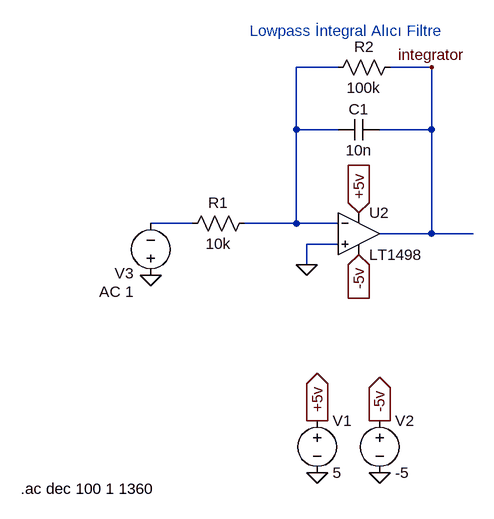
[diagram p0: schematic fluxgateACAnaliz.asc]
fluxgateACAnaliz.asc, the LTspice schematic file:
Version 4
SHEET 1 880 680
WIRE 464 -208 400 -208
WIRE 608 -208 544 -208
WIRE 400 -112 400 -208
WIRE 464 -112 400 -112
WIRE 608 -112 608 -208
WIRE 608 -112 528 -112
WIRE 240 32 176 32
WIRE 400 32 400 -112
WIRE 400 32 320 32
WIRE 464 32 400 32
WIRE 608 48 608 -112
WIRE 608 48 528 48
WIRE 672 48 608 48
WIRE 464 64 416 64
WIRE 416 96 416 64
FLAG 432 416 0
FLAG 432 336 +5v
IOPIN 432 336 Out
FLAG 528 416 0
FLAG 528 336 -5v
IOPIN 528 336 Out
FLAG 496 16 +5v
IOPIN 496 16 In
FLAG 496 80 -5v
IOPIN 496 80 In
FLAG 416 96 0
FLAG 608 -208 integrator
FLAG 176 112 0
SYMBOL voltage 432 320 R0
WINDOW 123 0 0 Left 0
WINDOW 39 0 0 Left 0
SYMATTR InstName V1
SYMATTR Value 5
SYMBOL voltage 528 320 R0
WINDOW 123 0 0 Left 0
WINDOW 39 0 0 Left 0
SYMATTR InstName V2
SYMATTR Value -5
SYMBOL OpAmps\\LT1498 496 -16 R0
SYMATTR InstName U2
SYMBOL res 336 16 R90
WINDOW 0 0 56 VBottom 2
WINDOW 3 32 56 VTop 2
SYMATTR InstName R1
SYMATTR Value 10k
SYMBOL cap 528 -128 R90
WINDOW 0 0 32 VBottom 2
WINDOW 3 32 32 VTop 2
SYMATTR InstName C1
SYMATTR Value 10n
SYMBOL res 560 -224 R90
WINDOW 0 0 56 VBottom 2
WINDOW 3 32 56 VTop 2
SYMATTR InstName R2
SYMATTR Value 100k
SYMBOL voltage 176 128 R180
WINDOW 3 -111 -24 Left 2
WINDOW 123 26 -9 Left 2
WINDOW 39 0 0 Left 0
WINDOW 0 26 19 Left 2
SYMATTR Value ""
SYMATTR Value2 AC 1
SYMATTR InstName V3
TEXT 328 -264 Left 2 ;Lowpass İntegral Alıcı Filtre
TEXT -24 440 Left 2 !.ac dec 100 1 1360

The netlist it stands for:
* fluxgateACAnaliz.asc
V1 +5v 0 5
V2 -5v 0 -5
XU2 0 N001 +5v -5v integrator LT1498  ; pins In+ In- V+ V- OUT
R1 N001 N002 10k
C1 integrator N001 10n
R2 integrator N001 100k
V3 0 N002 AC 1
* Lowpass İntegral Alıcı Filtre
.ac dec 100 1 1360
.lib LTC.lib
.backanno
.end